# EasyEDA Pro project 主轴转接板02.eprj

# Schematic 原理图
Board Name: 转接隔离板; Create Date: 2024-04-22; Page Name: 主控MCU; Project Name: 主轴转接板; Schematic Name: 原理图; Update Date: 2025-02-19; Company: 嘉立创EDA; Page Size: A3; Version: V1.0
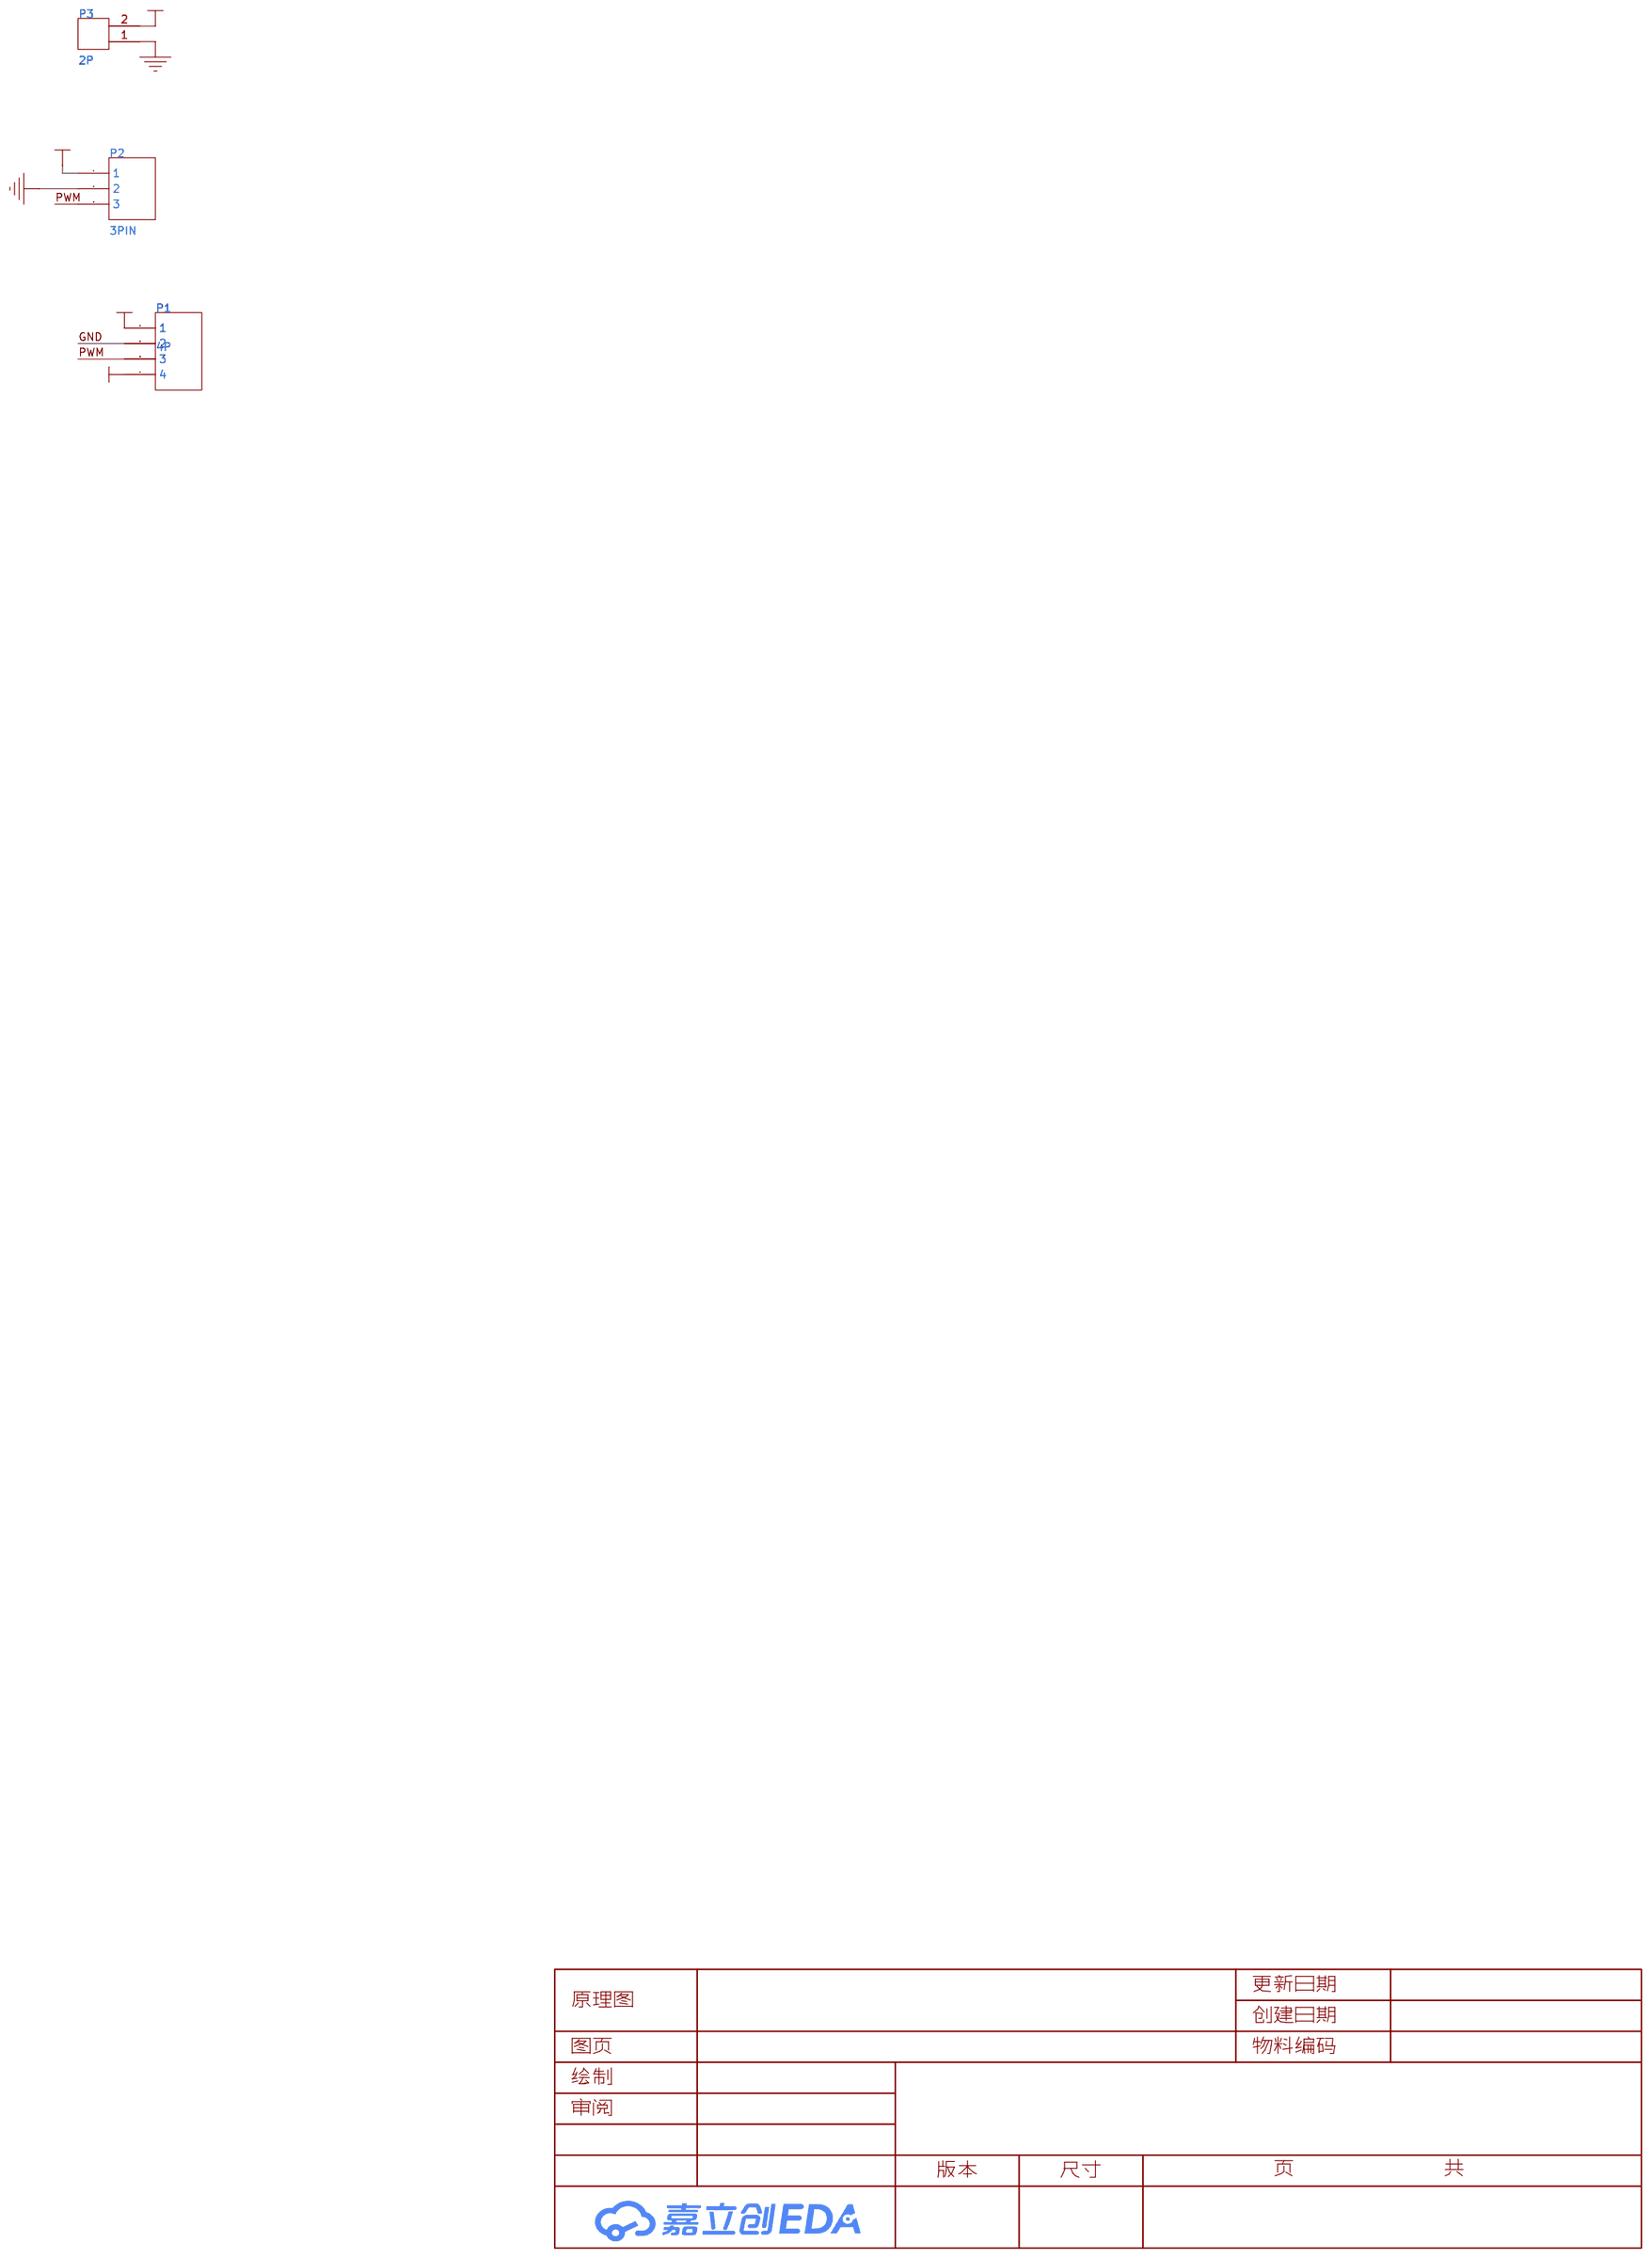
[diagram p0: schematic sheet]

## Parts
P1  4P  [SIP4]
P2  3PIN  [HDR1X3_P]
P3  2P  [HDR1X2_P]

## Library data of the parts
P1 = 4P: Library Name: SCH封装库
P2 = 3P: Library Name: SCH封装库
P3 = 2P: Library Name: SCH封装库

## Nets
12V: P1.4 P2.1
48V: P1.1 P3.2
GND: P1.2 P2.2 P3.1
PWM: P1.3 P2.3

# Board PCB_1
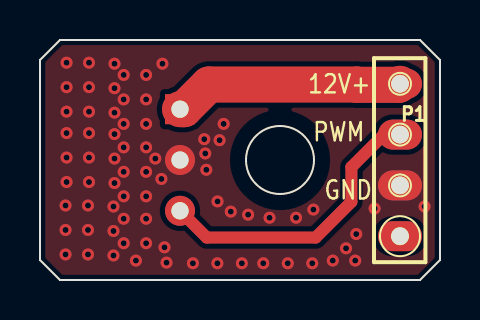
[diagram p1: board, top side]
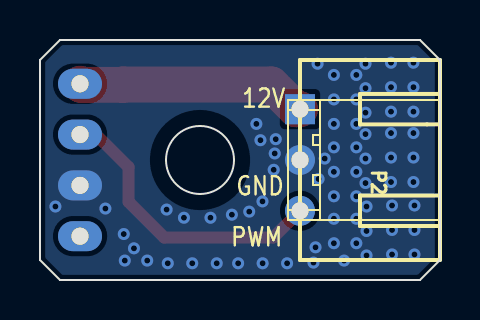
[diagram p2: board, bottom side, seen from below]

Outline 20 x 12 mm; copper layers: Top Layer, Bottom Layer. Coordinates in mm from the lower left corner of the outline.
Outline path: circle c12,6 r1.7 ; 0,11 0,1 1,0 19,0 20,1 20,11 19,12 1,12 0,11
Stack: Top Layer 0.035mm / Dielectric1 1.51mm FR4 er 4.5 / Bottom Layer 0.035mm

## Design rules (mm)
template: 用户自定义配置
spacing Default (default): track to track 0.152, other pairs 0 to 0.152
track width Default (default): min 0.254, default 0.254, max 25.4
differential pair differentialPair (default): width min 0.127, default 0.254, max 2.54; gap min 0.152, default 0.152
via Default (default): diameter min 0.25, default 0.61, max 100.025; hole min 0.2, default 0.305, max 59.995

## Placement (name value [footprint] x y rotation side)
P1  4P  [SIP4]  18 2.19 90 top
P2  3PIN  [HDR1X3_P]  7 6 90 bottom

## Footprints (pads in the part's own frame, mm; a bottom-side part is the same pattern mirrored in y, then rotated)
HDR1X3_P
  rect 1.5x1.5 hole 0.86: 1(2.54,0)
  round 1.5 hole 0.86: 2(0,0) 3(-2.54,0)
SIP4
  oval 1.5x2.2 hole 0.86: 1(0,0) 2(2.54,0) 3(5.08,0) 4(7.62,0)

## Nets
12V: P1.4 P2.1
48V: P1.1
GND: P1.2 P2.2
PWM: P1.3 P2.3

## Via types
v1: diameter 0.6, hole 0.3, Top Layer to Bottom Layer, 72 vias

## Routing (per net, layer and track width the routed paths; a pad name or vN(x,y) marks a point on that pad's centre or on a via; arc(x,y) is an arc through that point)
12V: length 11.5
  Top Layer w1.8: P2.1 7.2,8.54 8.44,9.77 15.84,9.77 15.85,9.76 17.95,9.76 P1.4
GND:
  vias: v1(1.28,3.73) v1(1.28,2.5) v1(1.28,1.28) v1(1.33,10.87) v1(1.33,9.64) v1(1.33,8.42) v1(1.33,7.35) v1(1.33,6.12) v1(1.33,4.9) v1(2.4,3.73) v1(2.4,2.5) v1(2.4,1.28) v1(2.45,10.87) v1(2.45,9.64) v1(2.45,8.42) v1(2.45,7.35) v1(2.45,6.12) v1(2.45,4.9) v1(3.67,3.67) v1(3.67,2.45) v1(3.67,1.23) v1(3.73,10.81) v1(3.73,9.59) v1(3.73,8.37) v1(3.73,7.3) v1(3.73,6.07) v1(3.73,4.85) v1(4.18,10.25) v1(4.18,9.03) v1(4.18,7.81) v1(4.18,6.63) v1(4.18,5.41) v1(4.18,4.18) v1(4.18,3.06) v1(4.18,1.84) v1(4.8,0.97) v1(5.31,10.25) v1(5.31,9.03) v1(5.31,7.81) v1(5.31,6.63) v1(5.31,5.41) v1(5.31,4.18) v1(5.31,3.06) v1(5.31,1.84) v1(5.77,6.07) v1(6.07,5.05) v1(6.12,10.81) v1(6.22,1.63) v1(6.33,0.87) v1(7.65,0.84) v1(8.21,7.04) v1(8.26,6.33) v1(8.31,5.51) v1(8.88,3.93) v1(8.87,0.84) v1(8.98,6.99) v1(9.18,7.81) v1(9.54,3.42) v1(10.09,0.84) v1(10.41,3.27) v1(11.16,0.84) v1(11.48,3.11) v1(12.39,0.84) v1(12.8,3.11) v1(13.61,0.84) v1(13.67,3.52) v1(14.64,0.97) v1(15.3,1.58) v1(15.81,2.3) v1(15.76,0.97) v1(16.73,3.57) v1(19.23,3.67)
PWM: length 14.7
  Top Layer w0.6: P2.3 8.34,2.12 13.78,2.12 15.57,3.91 15.57,5.64 17.2,7.27 P1.3

## Copper pours and planes (outline as drawn; the poured copper is in the pictures)
GND on Top Layer: -0.95,12.73 20.67,12.73 20.67,-0.88 -0.95,-0.88
GND on Bottom Layer: -0.75,12.48 20.72,12.48 20.72,-0.53 -0.75,-0.53

## Text on the board
Bottom Silkscreen Layer: 12V | GND | PWM
Top Silkscreen Layer: 12V+ | PWM | GND
